# Altium schematic sheet ControleEmbalagem.SchDoc: CONTROLADORA MAIS PIPOCA - REVISÃO EMC
size A3; DocumentNumber: GA0078; SheetNumber: 5; SheetTotal: 17
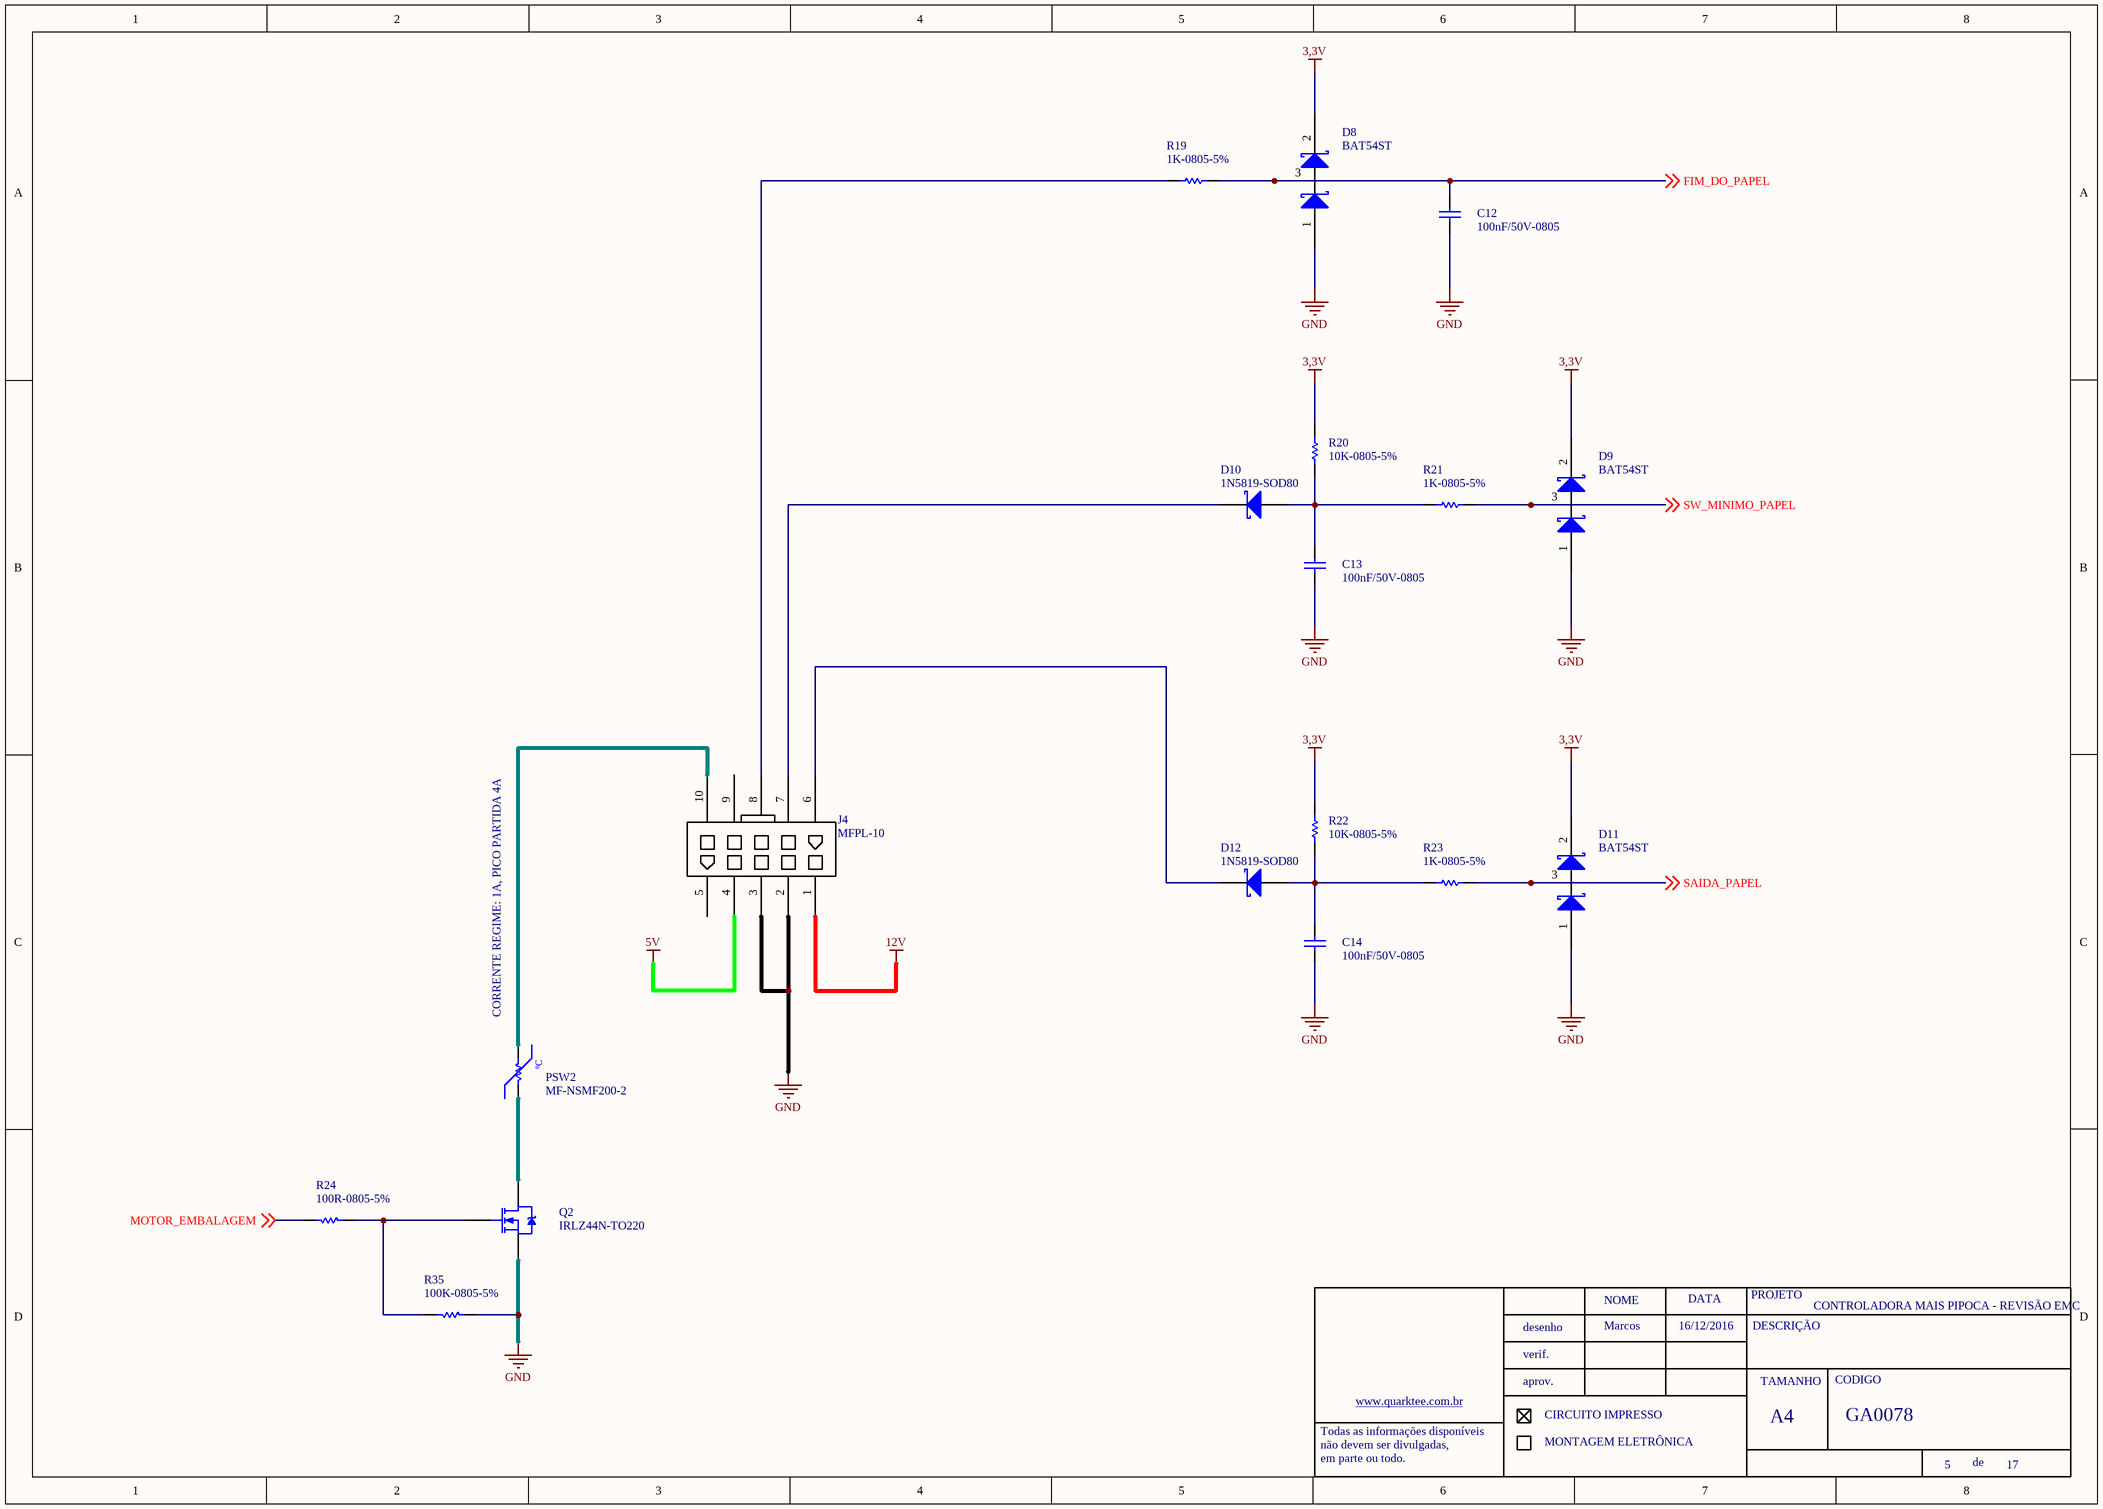
[diagram p0: ControleEmbalagem.SchDoc]

## Parts
C12  100nF/50V-0805  [0805-REVISADO ONDA]
C13  100nF/50V-0805  [0805-REVISADO ONDA]
C14  100nF/50V-0805  [0805-REVISADO ONDA]
D8  BAT54ST  [SOT23 - REVISADO ONDA]
D9  BAT54ST  [SOT23 - REVISADO ONDA]
D10  1N5819-SOD80  [MINIMLEF/SOD80 - REVISADO ONDA]
D11  BAT54ST  [SOT23 - REVISADO ONDA]
D12  1N5819-SOD80  [MINIMLEF/SOD80 - REVISADO ONDA]
J4  MFPL-10
PSW2  MF-NSMF200-2  [1206-REVISADO ONDA]
Q2  IRLZ44N-TO220  [TO220-3 EM PÉ]
R19  1K-0805-5%  [0805-REVISADO ONDA]
R20  10K-0805-5%  [0805-REVISADO ONDA]
R21  1K-0805-5%  [0805-REVISADO ONDA]
R22  10K-0805-5%  [0805-REVISADO ONDA]
R23  1K-0805-5%  [0805-REVISADO ONDA]
R24  100R-0805-5%  [0805-REVISADO ONDA]
R35  100K-0805-5%  [0805-REVISADO ONDA]

## Nets
3,3V: D8.2 D9.2 D11.2 R20.2 R22.2
5V: J4.4
12V: J4.1
GND: C12.1 C13.1 C14.1 D8.1 D9.1 D11.1 J4.2 J4.3 Q2.3(S) R35.1
FIM_DO_PAPEL: C12.2 D8.3 R19.2 ; off-sheet FIM_DO_PAPEL
MOTOR_EMBALAGEM: R24.2 ; off-sheet MOTOR_EMBALAGEM
SAIDA_PAPEL: D11.3 R23.2 ; off-sheet SAIDA_PAPEL
SW_MINIMO_PAPEL: D9.3 R21.2 ; off-sheet SW_MINIMO_PAPEL
NetC13_2: C13.2 D10.1(A) R20.1 R21.1
NetC14_2: C14.2 D12.1(A) R22.1 R23.1
NetD10_2: D10.2(K) J4.7
NetD12_2: D12.2(K) J4.6
NetJ4_8: J4.8 R19.1
NetJ4_10: J4.10 PSW2.2
NetPSW2_1: PSW2.1 Q2.2(D)
NetQ2_1: Q2.1(G) R24.1 R35.2

Not connected (* = marked no-connect by the designer): J4 5 9

## Notes on the sheet
- (near PSW2) CORRENTE REGIME: 1A, PICO PARTIDA 4A
- Marcos
- 16/12/2016
- NOME
- DATA
- PROJETO
- DESCRIÇÃO
- desenho
- verif.
- aprov.
- TAMANHO
- CODIGO
- Todas as informações disponíveis
- não devem ser divulgadas,
- em parte ou todo.
- www.quarktee.com.br
- CIRCUITO IMPRESSO
- MONTAGEM ELETRÔNICA
- A4
- de
- (in symbol POLYSWITCH 200mA) ºC

## Library data of the parts
C12-C14 = 100nF/50-0805-NPO: ERP: 104.11.005
PSW2 = POLYSWITCH 200mA: NANOSMDC020F-2; ERP: 128.12.002
D10 D12 = 1N5819-SOD80: ERP: 121.18.003
Q2 = IRLZ44N-TO220: ERP: 107.01.006
R19 R21 R23 = 1K-0805-5%: ERP: 102.11.042
R20 R22 = 10K-0805-5%: ERP: 102.11.054
R24 = 100R-0805-5%: ERP: 102.11.031
R35 = 100K-0805-5%: ERP: 102.11.066